# EAGLE design Indev 4 (EAGLE 6.3)
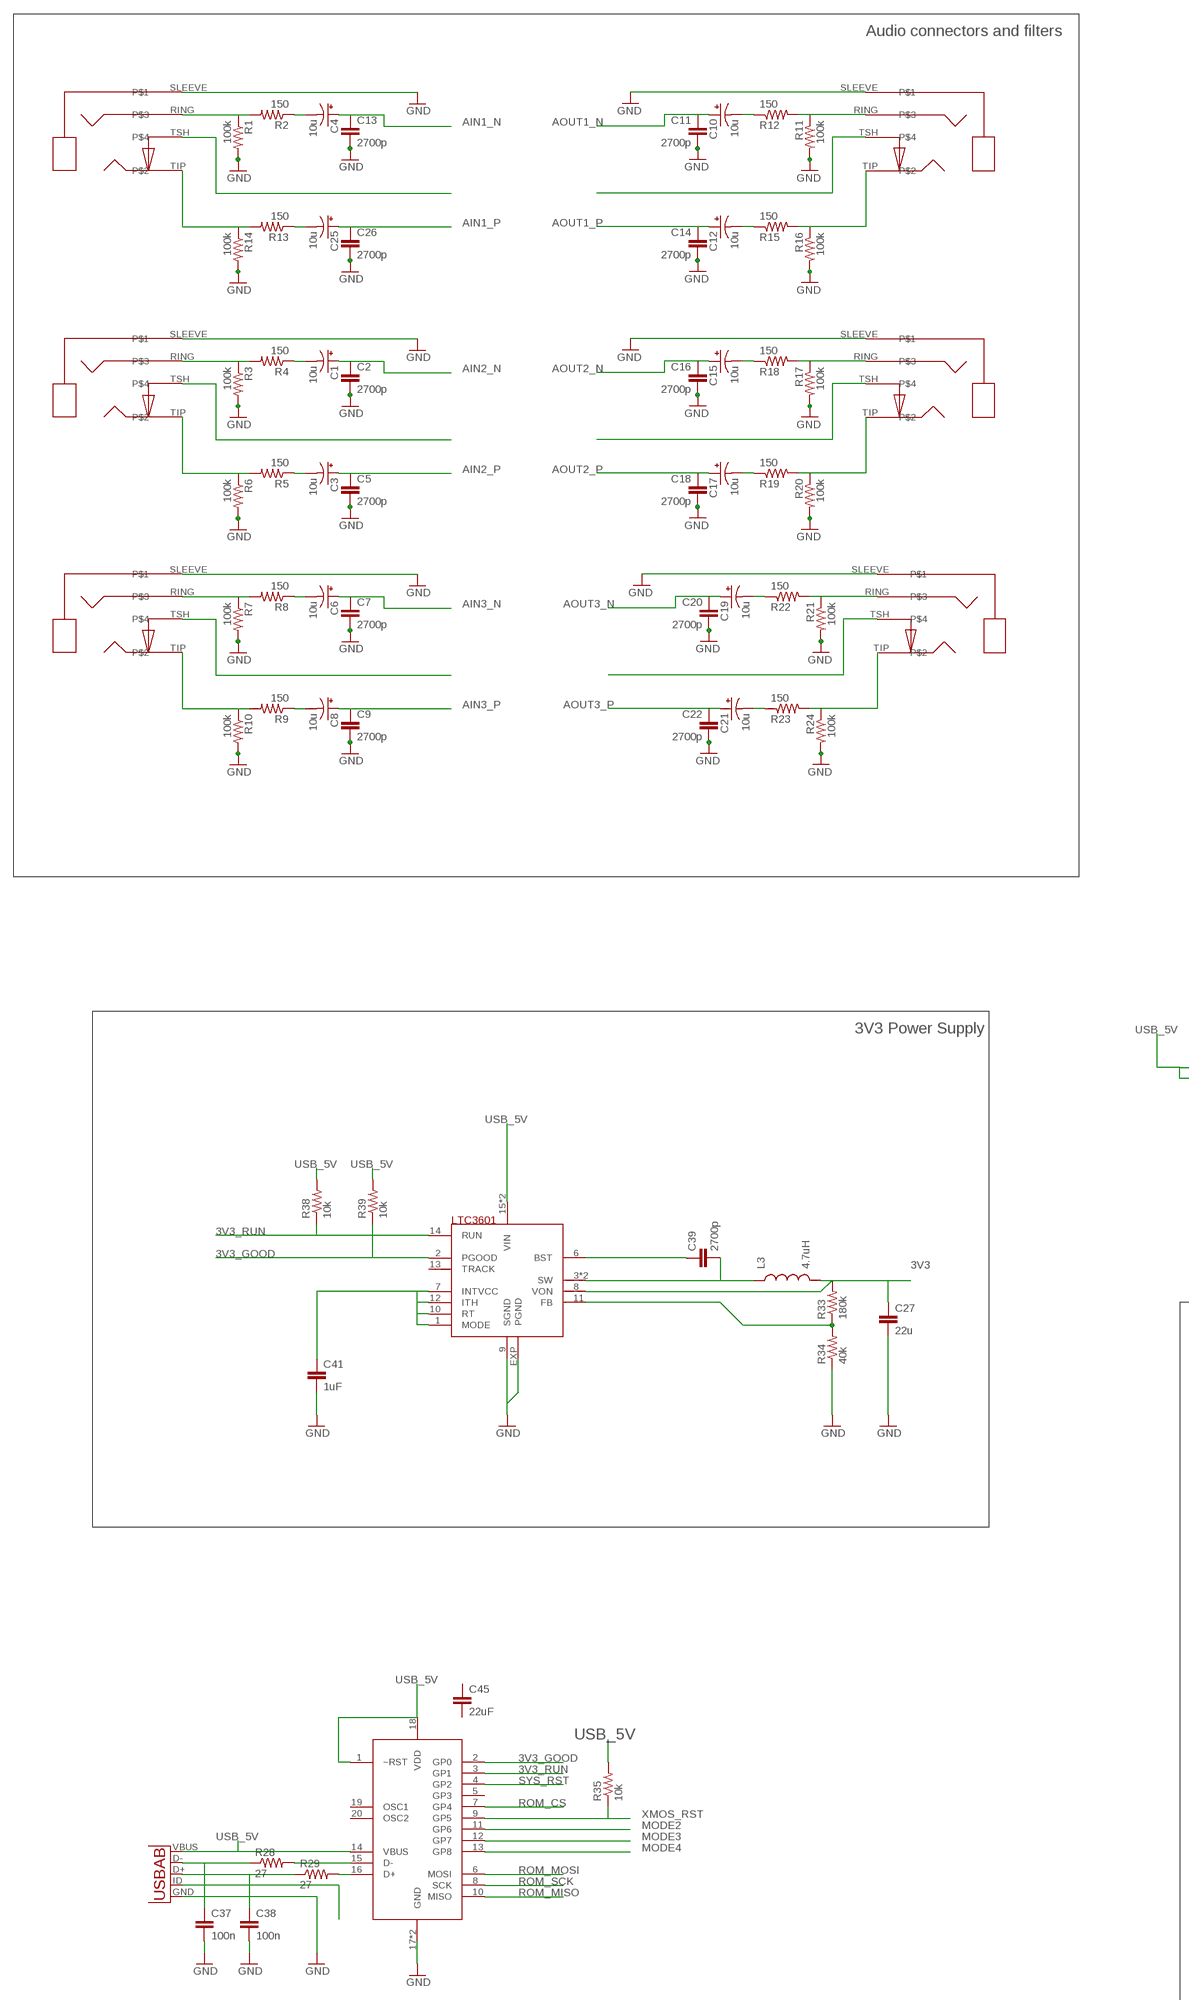
[diagram p0: schematic, sheet 1, part 1 of 2]
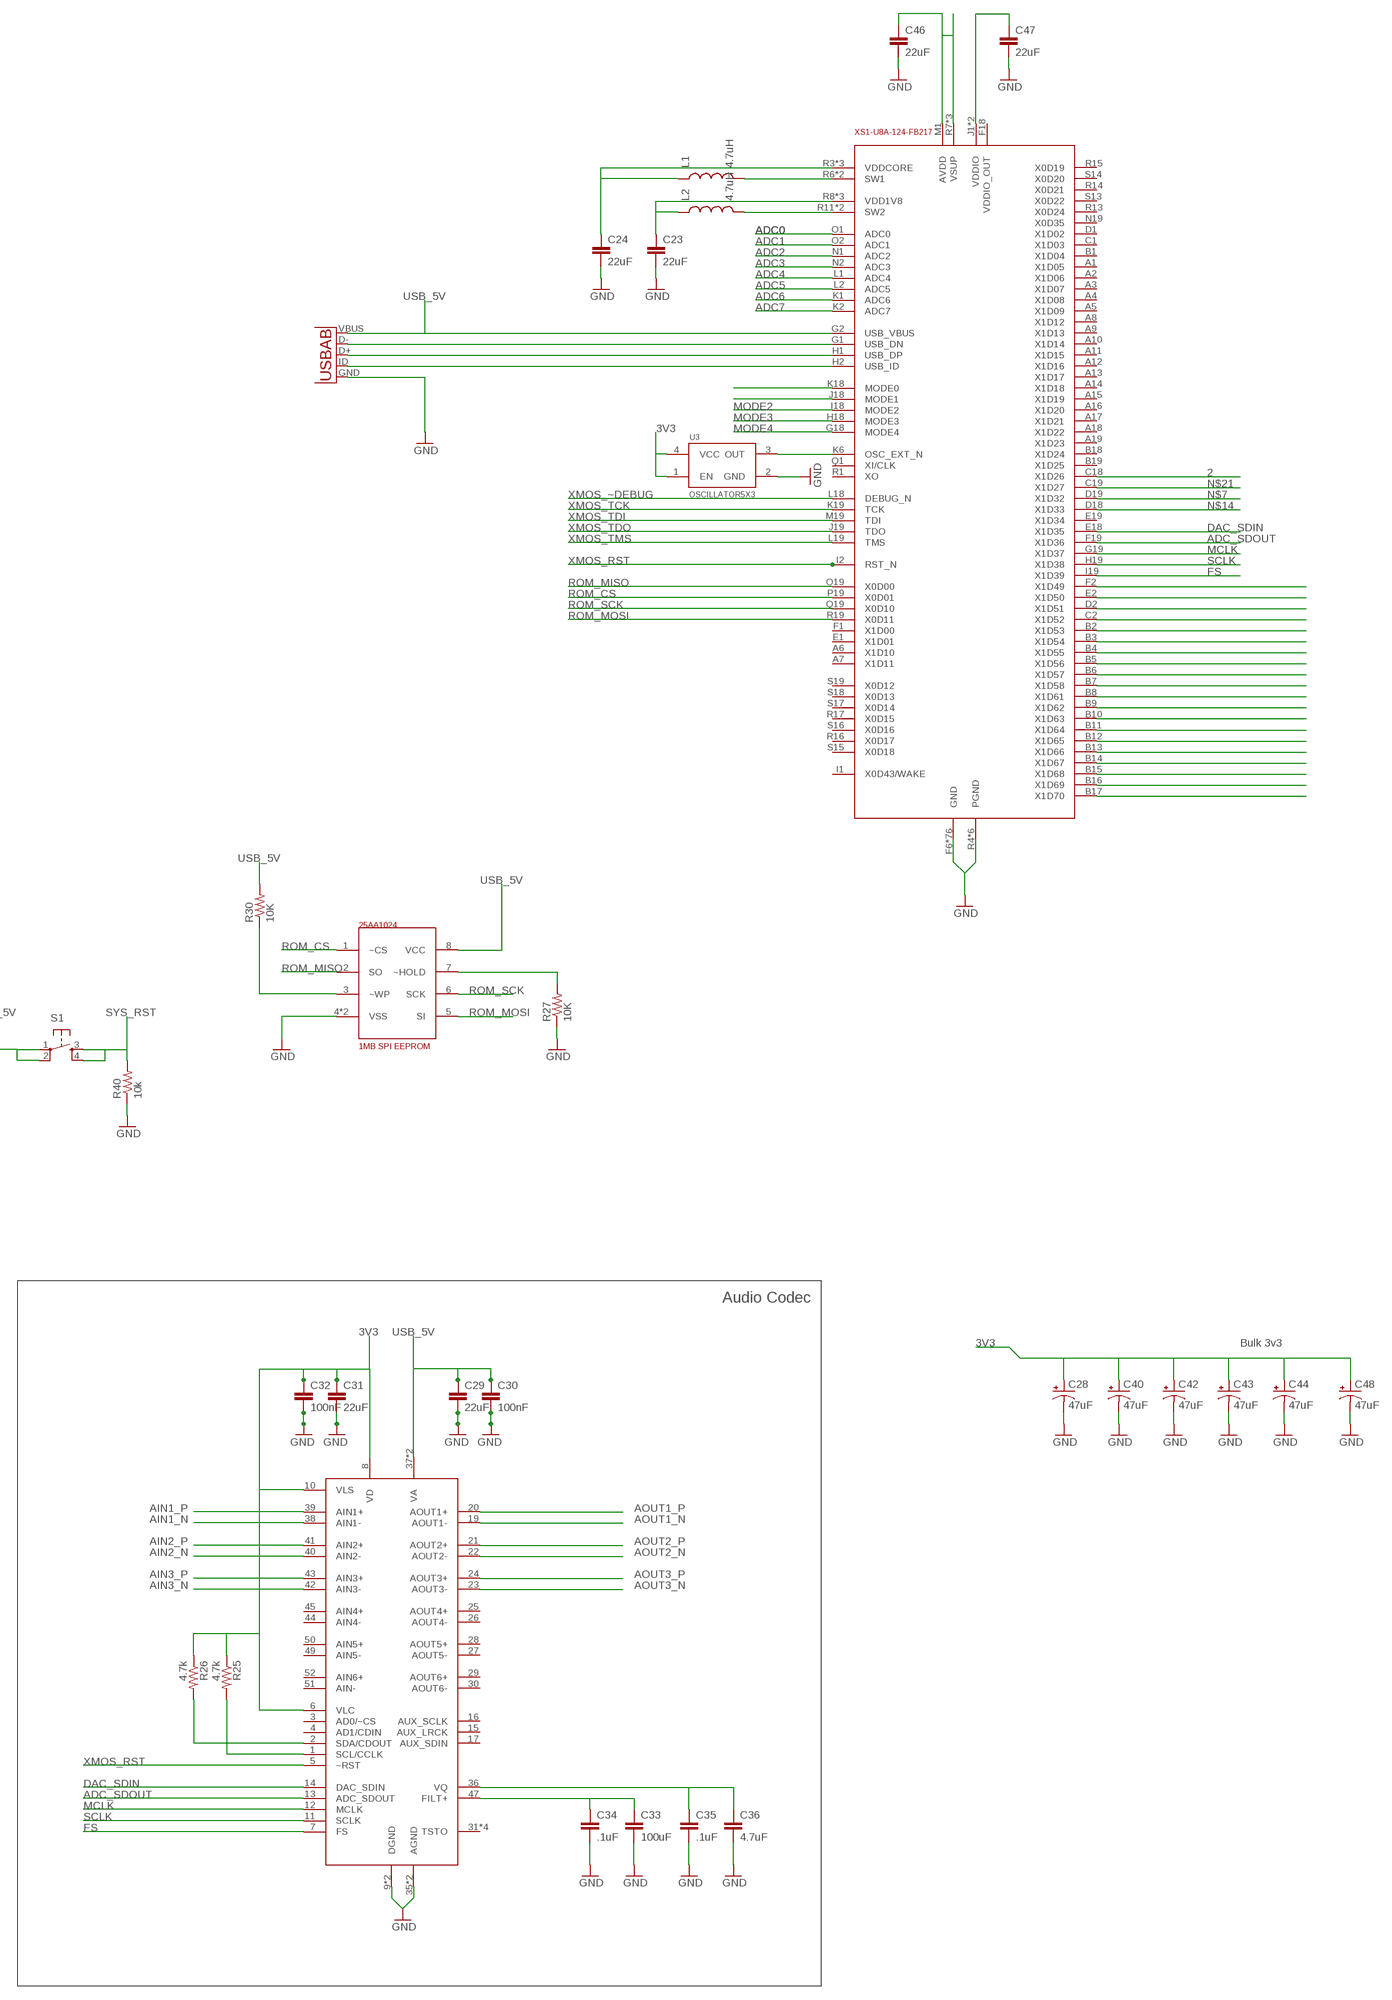
[diagram p1: schematic, sheet 1, part 2 of 2]

## Parts
C1  10u  CPOL-USB  [PANASONIC_B]
C2  2700p  CAP0603-CAP  [0603-CAP]
C3  10u  CPOL-USB  [PANASONIC_B]
C4  10u  CPOL-USB  [PANASONIC_B]
C5  2700p  CAP0603-CAP  [0603-CAP]
C6  10u  CPOL-USB  [PANASONIC_B]
C7  2700p  CAP0603-CAP  [0603-CAP]
C8  10u  CPOL-USB  [PANASONIC_B]
C9  2700p  CAP0603-CAP  [0603-CAP]
C10  10u  CPOL-USB  [PANASONIC_B]
C11  2700p  CAP0603-CAP  [0603-CAP]
C12  10u  CPOL-USB  [PANASONIC_B]
C13  2700p  CAP0603-CAP  [0603-CAP]
C14  2700p  CAP0603-CAP  [0603-CAP]
C15  10u  CPOL-USB  [PANASONIC_B]
C16  2700p  CAP0603-CAP  [0603-CAP]
C17  10u  CPOL-USB  [PANASONIC_B]
C18  2700p  CAP0603-CAP  [0603-CAP]
C19  10u  CPOL-USB  [PANASONIC_B]
C20  2700p  CAP0603-CAP  [0603-CAP]
C21  10u  CPOL-USB  [PANASONIC_B]
C22  2700p  CAP0603-CAP  [0603-CAP]
C23  22uF  CAP0603-CAP  [0603-CAP]
C24  22uF  CAP0603-CAP  [0603-CAP]
C25  10u  CPOL-USB  [PANASONIC_B]
C26  2700p  CAP0603-CAP  [0603-CAP]
C27  22u  CAP0603-CAP  [0603-CAP]
C28  47uF  47UF-TANT  [EIA3528]
C29  22uF  CAP0402-CAP  [0402-CAP]
C30  100nF  CAP0402-CAP  [0402-CAP]
C31  22uF  CAP0402-CAP  [0402-CAP]
C32  100nF  CAP0402-CAP  [0402-CAP]
C33  100uF  CAP0402-CAP  [0402-CAP]
C34  .1uF  CAP0402-CAP  [0402-CAP]
C35  .1uF  CAP0402-CAP  [0402-CAP]
C36  4.7uF  CAP0402-CAP  [0402-CAP]
C37  100n  CAP0603-CAP  [0603-CAP]
C38  100n  CAP0603-CAP  [0603-CAP]
C39  2700p  CAP0603-CAP  [0603-CAP]
C40  47uF  47UF-TANT  [EIA3528]
C41  1uF  CAP0603-CAP  [0603-CAP]
C42  47uF  47UF-TANT  [EIA3528]
C43  47uF  47UF-TANT  [EIA3528]
C44  47uF  47UF-TANT  [EIA3528]
C45  22uF  CAP0402-CAP  [0402-CAP]
C46  22uF  CAP0402-CAP  [0402-CAP]
C47  22uF  CAP0402-CAP  [0402-CAP]
C48  47uF  47UF-TANT  [EIA3528]
J1  SJ3524_AUDIO  [SJ3524_AUDIO]
J2  SJ3524_AUDIO  [SJ3524_AUDIO]
J3  SJ3524_AUDIO  [SJ3524_AUDIO]
J4  SJ3524_AUDIO  [SJ3524_AUDIO]
J5  SJ3524_AUDIO  [SJ3524_AUDIO]
J6  SJ3524_AUDIO  [SJ3524_AUDIO]
L1  4.7uH  INDUCTOR1210  [1210]
L2  4.7uH  INDUCTOR1210  [1210]
L3  4.7uH  INDUCTOR1210  [1210]
R1  100k  R-US_R0402  [R0402]
R2  150  R-US_R0402  [R0402]
R3  100k  R-US_R0402  [R0402]
R4  150  R-US_R0402  [R0402]
R5  150  R-US_R0402  [R0402]
R6  100k  R-US_R0402  [R0402]
R7  100k  R-US_R0402  [R0402]
R8  150  R-US_R0402  [R0402]
R9  150  R-US_R0402  [R0402]
R10  100k  R-US_R0402  [R0402]
R11  100k  R-US_R0402  [R0402]
R12  150  R-US_R0402  [R0402]
R13  150  R-US_R0402  [R0402]
R14  100k  R-US_R0402  [R0402]
R15  150  R-US_R0402  [R0402]
R16  100k  R-US_R0402  [R0402]
R17  100k  R-US_R0402  [R0402]
R18  150  R-US_R0402  [R0402]
R19  150  R-US_R0402  [R0402]
R20  100k  R-US_R0402  [R0402]
R21  100k  R-US_R0402  [R0402]
R22  150  R-US_R0402  [R0402]
R23  150  R-US_R0402  [R0402]
R24  100k  R-US_R0402  [R0402]
R25  4.7k  R-US_R0402  [R0402]
R26  4.7k  R-US_R0402  [R0402]
R27  10K  R-US_R0402  [R0402]
R28  27  R-US_R0402  [R0402]
R29  27  R-US_R0402  [R0402]
R30  10K  R-US_R0402  [R0402]
R33  180k  R-US_R0402  [R0402]
R34  40k  R-US_R0402  [R0402]
R35  10k  R-US_R0402  [R0402]
R38  10k  R-US_R0402  [R0402]
R39  10k  R-US_R0402  [R0402]
R40  10k  R-US_R0402  [R0402]
S1  TAC_SWITCHSMD  [TACTILE_SWITCH_SMD]
U1  USB-AB  [USB-AB-MICRO-SMD]
U2  USB-AB  [USB-AB-MICRO-SMD]
U3  OSCILLATOR5X3  [CRYSTAL-SMD-5X3]
U$1  LTC3601  [QFN16-3X3]
U$2  25AA1024DFN  [DFN8-5X6]
U$3  CS42436  [QFP-52]
U$4  MCP2210QFN  [20-QFN(5X5)]
U$6  XS1-U8A-124-FB217  [217-BGA(.8MM)]

## Nets
2: U$6.C18(X1D26)
3V3: C27.1 C28.A(+) C31.1 C32.1 C40.A(+) C42.A(+) C43.A(+) C44.A(+) C46.1 C47.1 C48.A(+) L3.2 R25.1 R26.1 R33.2 U3.1(EN) U3.4(VCC) U$1.8(VON) U$3.6(VLC) U$3.8(VD) U$3.10(VLS) U$6.J1(VDDIO) U$6.J2(VDDIO) U$6.M1(AVDD) U$6.R7(VSUP) U$6.S1(VSUP) U$6.S7(VSUP)
3V3_GOOD: R39.1 U$1.2(PGOOD) U$4.2(GP0)
3V3_RUN: R38.1 U$1.14(RUN) U$4.3(GP1)
ADC0: U$6.O1(ADC0)
ADC1: U$6.O2(ADC1)
ADC2: U$6.N1(ADC2)
ADC3: U$6.N2(ADC3)
ADC4: U$6.L1(ADC4)
ADC5: U$6.L2(ADC5)
ADC6: U$6.K1(ADC6)
ADC7: U$6.K2(ADC7)
ADC_SDOUT: U$3.13(ADC_SDOUT) U$6.F19(X1D36)
AIN1_N: C4.+ C13.1 U$3.38(AIN1-)
AIN1_P: C25.+ C26.1 U$3.39(AIN1+)
AIN2_N: C1.+ C2.1 U$3.40(AIN2-)
AIN2_P: C3.+ C5.1 U$3.41(AIN2+)
AIN3_N: C6.+ C7.1 U$3.42(AIN3-)
AIN3_P: C8.+ C9.1 U$3.43(AIN3+)
AOUT1_N: C10.+ C11.1 U$3.19(AOUT1-)
AOUT1_P: C12.+ C14.1 U$3.20(AOUT1+)
AOUT2_N: C15.+ C16.1 U$3.22(AOUT2-)
AOUT2_P: C17.+ C18.1 U$3.21(AOUT2+)
AOUT3_N: C19.+ C20.1 U$3.23(AOUT3-)
AOUT3_P: C21.+ C22.1 U$3.24(AOUT3+)
CH1_IN: J1.TSH
CH1O_IN: J4.TSH
CH2_IN: J2.TSH
CH2O_IN: J5.TSH
CH3_IN: J3.TSH
CH3O_IN: J6.TSH
DAC_SDIN: U$3.14(DAC_SDIN) U$6.E18(X1D35)
FB: R33.1 R34.2 U$1.11(FB)
FS: U$3.7(FS) U$6.I19(X1D39)
GND: C2.2 C5.2 C7.2 C9.2 C11.2 C13.2 C14.2 C16.2 C18.2 C20.2 C22.2 C23.2 C24.2 C26.2 C27.2 C28.C(-) C29.2 C30.2 C31.2 C32.2 C33.2 C34.2 C35.2 C36.2 C37.2 C38.2 C40.C(-) C41.2 C42.C(-) C43.C(-) C44.C(-) C46.2 C47.2 C48.C(-) J1.SLEEVE J2.SLEEVE J3.SLEEVE J4.SLEEVE J5.SLEEVE J6.SLEEVE R1.2 R3.2 R6.2 R7.2 R10.2 R11.2 R14.2 R16.2 R17.2 R20.2 R21.2 R24.2 R27.1 R34.1 R40.1 U1.GND U2.GND U3.2(GND) U$1.9(SGND) U$1.EXP(PGND) U$2.4(VSS) U$2.PAD(VSS) U$3.9(DGND) U$3.18(DGND) U$3.35(AGND) U$3.48(AGND) U$4.17(GND) U$4.PAD(GND) U$6.F6(GND) U$6.F7(GND) U$6.F8(GND) U$6.F9(GND) U$6.F10(GND) U$6.F11(GND) U$6.F12(GND) U$6.F13(GND) U$6.F14(GND) U$6.G6(GND) U$6.G7(GND) U$6.G8(GND) U$6.G9(GND) U$6.G10(GND) U$6.G11(GND) U$6.G12(GND) U$6.G13(GND) U$6.G14(GND) U$6.H6(GND) U$6.H7(GND) U$6.H8(GND) U$6.H9(GND) U$6.H10(GND) U$6.H11(GND) U$6.H12(GND) U$6.H13(GND) U$6.H14(GND) U$6.I6(GND) U$6.I7(GND) U$6.I8(GND) U$6.I9(GND) U$6.I10(GND) U$6.I11(GND) U$6.I12(GND) U$6.I13(GND) U$6.I14(GND) U$6.J6(GND) U$6.J7(GND) U$6.J8(GND) U$6.J9(GND) U$6.J10(GND) U$6.J11(GND) U$6.J12(GND) U$6.J13(GND) U$6.J14(GND) U$6.K7(GND) U$6.K8(GND) U$6.K9(GND) U$6.K10(GND) U$6.K11(GND) U$6.K12(GND) U$6.K13(GND) U$6.K14(GND) U$6.L8(GND) U$6.L9(GND) U$6.L10(GND) U$6.L11(GND) U$6.L12(GND) U$6.L13(GND) U$6.L14(GND) U$6.M8(GND) U$6.M9(GND) U$6.M10(GND) U$6.M11(GND) U$6.M12(GND) U$6.M13(GND) U$6.M14(GND) U$6.N6(GND) U$6.N7(GND) U$6.N8(GND) U$6.N9(GND) U$6.N10(GND) U$6.N11(GND) U$6.N12(GND) U$6.N13(GND) U$6.N14(GND) U$6.R4(PGND) U$6.R5(PGND) U$6.R9(PGND) U$6.R10(PGND) U$6.S5(PGND) U$6.S10(PGND)
MCLK: U$3.12(MCLK) U$6.G19(X1D37)
MODE2: U$4.11(GP6) U$6.I18(MODE2)
MODE3: U$4.12(GP7) U$6.H18(MODE3)
MODE4: U$4.13(GP8) U$6.G18(MODE4)
N$1: J1.TIP R13.2 R14.1
N$2: J1.RING R1.1 R2.2
N$3: C4.- R2.1
N$4: C33.1 C34.1 U$3.47(FILT+)
N$5: C25.- R13.1
N$6: C35.1 C36.1 U$3.36(VQ)
N$7: U$6.D19(X1D32)
N$8: J2.RING R3.1 R4.2
N$9: C1.- R4.1
N$10: U$6.K18(MODE0)
N$11: J2.TIP R5.2 R6.1
N$12: C3.- R5.1
N$13: R30.1 U$2.3(~WP)
N$14: U$6.D18(X1D33)
N$15: J3.RING R7.1 R8.2
N$16: C6.- R8.1
N$17: U1.ID(USBID)
N$18: J3.TIP R9.2 R10.1
N$19: C8.- R9.1
N$20: C39.1 U$1.6(BST)
N$21: U$6.C19(X1D27)
N$22: J4.RING R11.1 R12.2
N$23: C10.- R12.1
N$24: C37.1 R28.1 U1.D-
N$25: J4.TIP R15.2 R16.1
N$26: C12.- R15.1
N$29: J5.RING R17.1 R18.2
N$30: C15.- R18.1
N$31: R25.2 U$3.1(SCL/CCLK)
N$32: J5.TIP R19.2 R20.1
N$33: C17.- R19.1
N$34: R26.2 U$3.2(SDA/CDOUT)
N$35: U$6.B17(X1D70)
N$36: J6.RING R21.1 R22.2
N$37: C19.- R22.1
N$39: J6.TIP R23.2 R24.1
N$40: C21.- R23.1
N$41: C38.1 R29.1 U1.D+
N$42: U$6.B16(X1D69)
N$43: R28.2 U$4.15(D-)
N$44: R29.2 U$4.16(D+)
N$46: R27.2 U$2.7(~HOLD)
N$47: U$6.B15(X1D68)
N$48: U$6.B14(X1D67)
N$49: U$6.B13(X1D66)
N$50: U$6.B12(X1D65)
N$51: U$6.B11(X1D64)
N$52: U$6.B10(X1D63)
N$55: U3.3(OUT) U$6.K6(OSC_EXT_N)
N$56: U$6.J18(MODE1)
N$57: L2.2 U$6.R11(SW2) U$6.S11(SW2)
N$58: L1.2 U$6.R6(SW1) U$6.S6(SW1)
N$59: C23.1 L2.1 U$6.R8(VDD1V8) U$6.S8(VDD1V8) U$6.S9(VDD1V8)
N$60: C24.1 L1.1 U$6.R3(VDDCORE) U$6.S3(VDDCORE) U$6.S4(VDDCORE)
N$61: U$6.B9(X1D62)
N$62: U$6.B8(X1D61)
N$63: U$6.F2(X1D49)
N$64: U$6.E2(X1D50)
N$65: U$6.B7(X1D58)
N$66: U$6.B6(X1D57)
N$67: U$6.B5(X1D56)
N$68: U$6.B4(X1D55)
N$69: U$6.B3(X1D54)
N$70: U$6.B2(X1D53)
N$71: U$6.C2(X1D52)
N$72: U$6.D2(X1D51)
ROM_CS: U$2.1(~CS) U$4.7(GP4) U$6.P19(X0D01)
ROM_MISO: U$2.2(SO) U$4.10(MISO) U$6.O19(X0D00)
ROM_MOSI: U$2.5(SI) U$4.6(MOSI) U$6.R19(X0D11)
ROM_SCK: U$2.6(SCK) U$4.8(SCK) U$6.Q19(X0D10)
SCLK: U$3.11(SCLK) U$6.H19(X1D38)
SW: C39.2 L3.1 U$1.3(SW) U$1.4(SW)
SYS_RST: R40.2 S1.3 S1.4 U$4.4(GP2)
TRACK/SS: C41.1 U$1.1(MODE) U$1.7(INTVCC) U$1.10(RT) U$1.12(ITH)
USB_5V: C29.1 C30.1 R30.2 R35.2 R38.2 R39.2 S1.1 S1.2 U1.VBUS U2.VBUS U$1.15(VIN) U$1.16(VIN) U$2.8(VCC) U$3.37(VA) U$3.46(VA) U$4.1(~RST) U$4.14(VBUS) U$4.18(VDD) U$6.G2(USB_VBUS)
XMOS_RST: R35.1 U$3.5(~RST) U$4.9(GP5) U$6.I2(RST_N)
XMOS_TCK: U$6.K19(TCK)
XMOS_TDI: U$6.M19(TDI)
XMOS_TDO: U$6.J19(TDO)
XMOS_TMS: U$6.L19(TMS)
XMOS_USB_ID: U2.ID(USBID) U$6.H2(USB_ID)
XMOS_USB_N: U2.D- U$6.G1(USB_DN)
XMOS_USB_P: U2.D+ U$6.H1(USB_DP)
XMOS_~DEBUG: U$6.L18(DEBUG_N)
Unconnected: C45.1 C45.2 U$1.13(TRACK) U$3.3(AD0/~CS) U$3.4(AD1/CDIN) U$3.15(AUX_LRCK) U$3.16(AUX_SCLK) U$3.17(AUX_SDIN) U$3.25(AOUT4+) U$3.26(AOUT4-) U$3.27(AOUT5-) U$3.28(AOUT5+) U$3.29(AOUT6+) U$3.30(AOUT6-) U$3.31(TSTO) U$3.32(TSTO) U$3.33(TSTO) U$3.34(TSTO) U$3.44(AIN4-) U$3.45(AIN4+) U$3.49(AIN5-) U$3.50(AIN5+) U$3.51(AIN-) U$3.52(AIN6+) U$4.5(GP3) U$4.19(OSC1) U$4.20(OSC2) U$6.A1(X1D05) U$6.A2(X1D06) U$6.A3(X1D07) U$6.A4(X1D08) U$6.A5(X1D09) U$6.A6(X1D10) U$6.A7(X1D11) U$6.A8(X1D12) U$6.A9(X1D13) U$6.A10(X1D14) U$6.A11(X1D15) U$6.A12(X1D16) U$6.A13(X1D17) U$6.A14(X1D18) U$6.A15(X1D19) U$6.A16(X1D20) U$6.A17(X1D21) U$6.A18(X1D22) U$6.A19(X1D23) U$6.B1(X1D04) U$6.B18(X1D24) U$6.B19(X1D25) U$6.C1(X1D03) U$6.D1(X1D02) U$6.E1(X1D01) U$6.E19(X1D34) U$6.F1(X1D00) U$6.F18(VDDIO_OUT) U$6.I1(X0D43/WAKE) U$6.N19(X0D35) U$6.Q1(XI/CLK) U$6.R1(XO) U$6.R13(X0D24) U$6.R14(X0D21) U$6.R15(X0D19) U$6.R16(X0D17) U$6.R17(X0D15) U$6.S13(X0D22) U$6.S14(X0D20) U$6.S15(X0D18) U$6.S16(X0D16) U$6.S17(X0D14) U$6.S18(X0D13) U$6.S19(X0D12)

## Notes on the sheet
- Audio connectors and filters
- 3V3 Power Supply
- Audio Codec
- Bulk 3v3

## Library data of the parts
C1 C3 C4 C6 C8 C10 C12 C15 C17 C19 C21 C25 = adafruit:CPOL-US: POLARIZED CAPACITOR, American symbol
C2 C5 C7 C9 C11 C13 C14 C16 C18 C20 C22-C24 C26 C27 C29-C39 C41 C45-C47 = 1x05smd:CAP: Capacitor Standard 0603 ceramic capacitor, and 0.1" leaded capacitor.
C28 C40 C42-C44 C48 = SparkFun-Capacitors:47UF-TANT: 47uF Tantalum SMT CAP-08310- 10V 10% (EIA-3528); PROD_ID: CAP-08310
J1-J6 = Strutz Electronic Industries:SJ3524_AUDIO
L1-L3 = SparkFun-Passives:INDUCTOR: Inductors Basic Inductor/Choke - 0603 and 1206. Footprints are not proven and vary greatly between part numbers. SRN6045- 33uH, 20% 1.4A SDR0403-560KL - 56uH, 10%, 500mA RMS/740mA peak
R1-R30 R33-R35 R38-R40 = adafruit:R-US_: RESISTOR, American symbol
S1 = SparkFun:TAC_SWITCH: Momentary Switch Button commonly used for reset or general input. Spark Fun Electronics SKU : COM-00097
U1 U2 = SparkFun-Connectors:USB-AB: This is a USB AB connector that is compatible with USB OTG. i.e. this connector can serve as a host or device
U3 = SparkFun-FreqCtrl:OSCILLATOR: Generic 5x3 and 7x5 oscillators
U$1 = Strutz Electronic Industries:LTC3601
U$2 = Strutz Electronic Industries:25AA1024: 1MB SPI EEPROM from Microchip Comes in PDIP, SSOP, DFN
U$3 = Strutz Electronic Industries:CS42436
U$4 = Strutz Electronic Industries:MCP2210: The USB to SPI bridge from Microchip Acts as SPI Master Also comes in SOIC-20 packages
U$6 = Strutz Electronic Industries:XS1-U8A-124-FB217

## Board
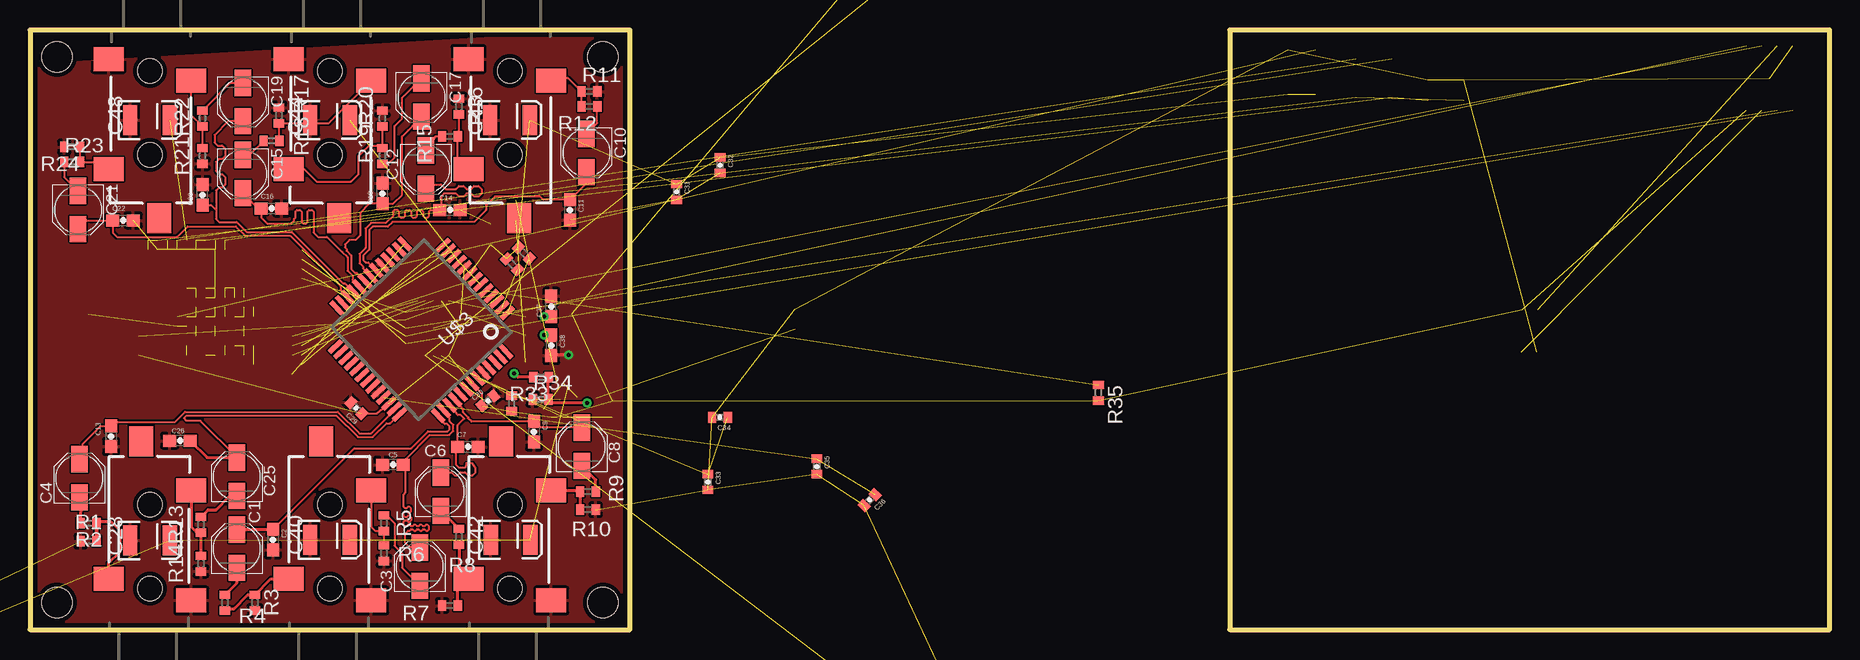
[diagram p2: board, top side]
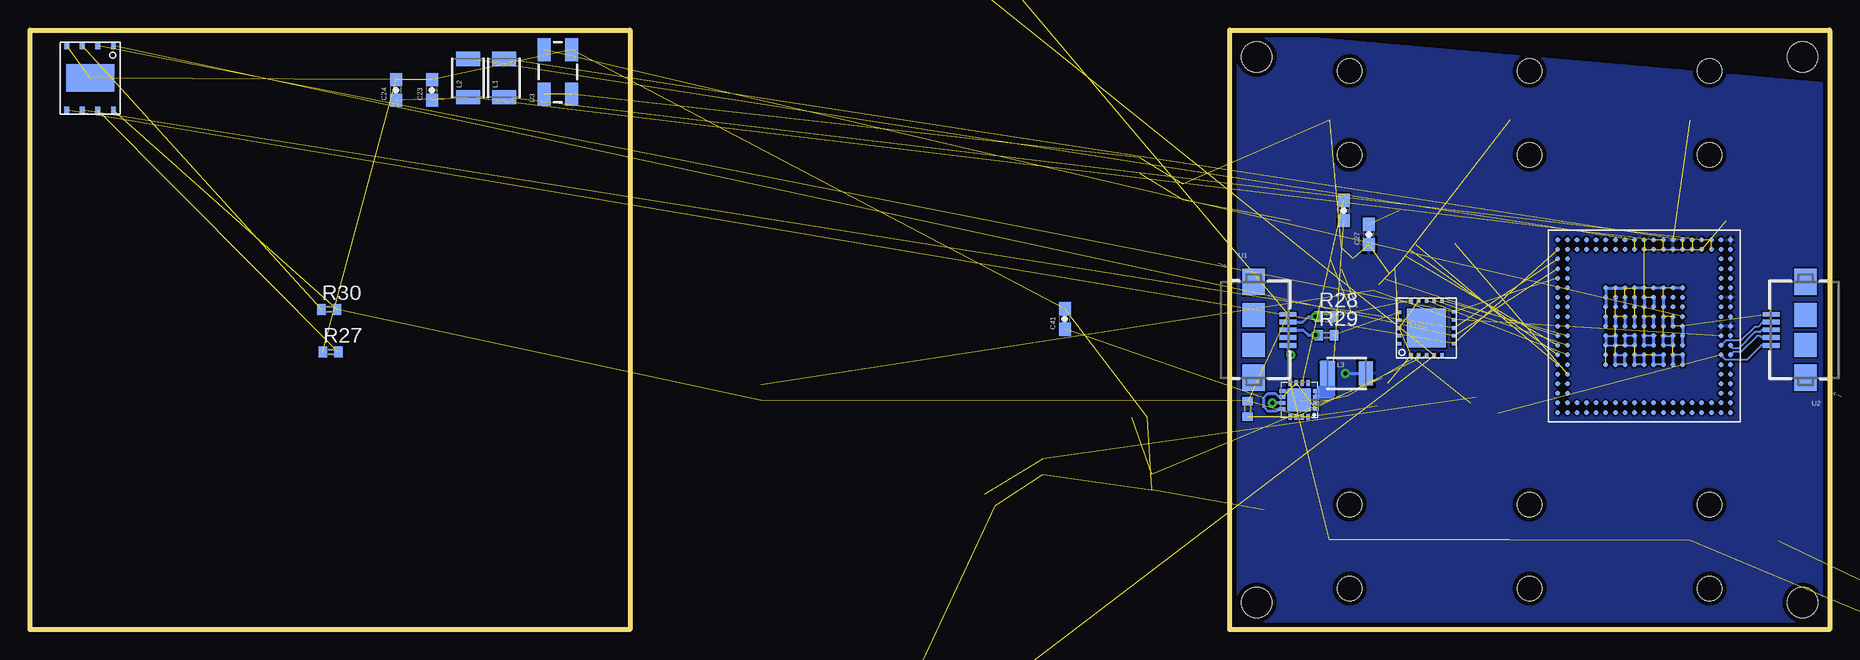
[diagram p3: board, bottom side, seen from below]

Size 150 x 50 mm. Coordinates in mm from the lower left corner, seen from the top.
Outline: 0,0 50,0 50,50 0,50 0,0
Outline: 100,0 150,0 150,50 100,50 100,0
Copper layers (1*16): Top 0.035mm / dielectric 1.5mm / Bottom 0.035mm
Design rules "default *": minimum track width 6mil, minimum drill 13mil, track to track 6mil, track to pad 6mil, pad to pad 6mil, via to via 6mil, smd to smd 6mil, copper to edge 15mil, drill to drill 6mil, minimum pad ring 10mil, minimum via ring 8mil, stop-mask expansion 4mil, vias tented up to drill 0mil, thermal gap 10mil
Holes 2.54 mm at 2.25,47.75 2.25,2.25 47.75,2.25 47.75,47.75

### Footprints (pad centres in the part's own frame; a part is rotated, then mirrored left to right if it is on the bottom)
PANASONIC_B = smd 2.2 x 1.4: + 1.6,0; - -1.6,0
0603-CAP = smd 1.1 x 1: 1 -0.85,0; 2 0.85,0
EIA3528 = smd 1.2 x 2.5: A 1.65,0; C -1.65,0
0402-CAP = smd 0.7 x 0.9: 1 -0.65,0; 2 0.65,0
SJ3524_AUDIO = smd 2 x 2.5: RING -0.78,3.45; SLEEVE -2.58,-3.45; TIP 6.62,-3.45 | smd 2.5 x 2: TSH 10.67,0.75 | hole 2: -1.58,0; 5.42,0
1210 = smd 1.2 x 2: 1 -1.6,0; 2 1.6,0
R0402 = smd 0.7 x 0.9: 1 -0.65,0; 2 0.65,0
TACTILE_SWITCH_SMD = smd 1.524 x 0.762: 1 -2.54,1.905; 2 2.54,1.905; 3 -2.54,-1.905; 4 2.54,-1.905
USB-AB-MICRO-SMD = smd 1.4 x 0.4: D+ 2.85,0; D- 2.85,0.65; GND 2.85,-1.3; ID 2.85,-0.65; VBUS 2.85,1.3 | smd 1.9 x 2: P$6 0,1.25; P$7 0,-1.25 | smd 1.9 x 2.2: P$8 0,4; P$9 0,-4
CRYSTAL-SMD-5X3 = smd 1.9 x 1.1: 1 -1.85,-1.15; 2 1.85,-1.15; 3 1.85,1.15; 4 -1.85,1.15
QFN16-3X3 = smd 0.5 x 0.3: 1 -1.4,0.75; 2 -1.4,0.25; 3 -1.4,-0.25; 4 -1.4,-0.75; 9 1.4,-0.75; 10 1.4,-0.25; 11 1.4,0.25; 12 1.4,0.75 | smd 0.3 x 0.5: 5 -0.75,-1.4; 6 -0.25,-1.4; 7 0.25,-1.4; 8 0.75,-1.4; 13 0.75,1.4; 14 0.25,1.4; 15 -0.25,1.4; 16 -0.75,1.4 | smd 1.95 x 1.95: EXP 0,0
DFN8-5X6 = smd 0.4 x 0.6: 1 -1.95,-2.7; 2 -0.65,-2.7; 3 0.65,-2.7; 4 1.95,-2.7; 5 1.95,2.7; 6 0.65,2.7; 7 -0.65,2.7; 8 -1.95,2.7 | smd 4 x 2.31: PAD 0,0
QFP-52 = smd 1.4 x 0.4: 1 -6.175,3.9; 2 -6.175,3.25; 3 -6.175,2.6; 4 -6.175,1.95; 5 -6.175,1.3; 6 -6.175,0.65; 7 -6.175,0; 8 -6.175,-0.65; 9 -6.175,-1.3; 10 -6.175,-1.95; 11 -6.175,-2.6; 12 -6.175,-3.25; 13 -6.175,-3.9; 27 6.175,-3.9; 28 6.175,-3.25; 29 6.175,-2.6; 30 6.175,-1.95; 31 6.175,-1.3; 32 6.175,-0.65; 33 6.175,0; 34 6.175,0.65; 35 6.175,1.3; 36 6.175,1.95; 37 6.175,2.6; 38 6.175,3.25; 39 6.175,3.9 | smd 0.4 x 1.4: 14 -3.9,-6.175; 15 -3.25,-6.175; 16 -2.6,-6.175; 17 -1.95,-6.175; 18 -1.3,-6.175; 19 -0.65,-6.175; 20 0,-6.175; 21 0.65,-6.175; 22 1.3,-6.175; 23 1.95,-6.175; 24 2.6,-6.175; 25 3.25,-6.175; 26 3.9,-6.175; 40 3.9,6.175; 41 3.25,6.175; 42 2.6,6.175; 43 1.95,6.175; 44 1.3,6.175; 45 0.65,6.175; 46 0,6.175; 47 -0.65,6.175; 48 -1.3,6.175; 49 -1.95,6.175; 50 -2.6,6.175; 51 -3.25,6.175; 52 -3.9,6.175
20-QFN(5X5) = smd 0.4 x 0.3: 1 -2.3,1.3; 2 -2.3,0.65; 3 -2.3,0; 4 -2.3,-0.65; 5 -2.3,-1.3; 11 2.3,-1.3; 12 2.3,-0.65; 13 2.3,0; 14 2.3,0.65; 15 2.3,1.3 | smd 0.3 x 0.4: 6 -1.3,-2.3; 7 -0.65,-2.3; 8 0,-2.3; 9 0.7,-2.3; 10 1.35,-2.3; 16 1.3,2.3; 17 0.65,2.3; 18 0,2.3; 19 -0.65,2.3; 20 -1.3,2.3 | smd 3.25 x 3.25: PAD 0,0
217-BGA(.8MM) = smd 0.4 x 0.4: A1 -7.2,7.2; A2 -6.4,7.2; A3 -5.6,7.2; A4 -4.8,7.2; A5 -4,7.2; A6 -3.2,7.2; A7 -2.4,7.2; A8 -1.6,7.2; A9 -0.8,7.2; A10 0,7.2; A11 0.8,7.2; A12 1.6,7.2; A13 2.4,7.2; A14 3.2,7.2; A15 4,7.2; A16 4.8,7.2; A17 5.6,7.2; A18 6.4,7.2; A19 7.2,7.2; B1 -7.2,6.4; B2 -6.4,6.4; B3 -5.6,6.4; B4 -4.8,6.4; B5 -4,6.4; B6 -3.2,6.4; B7 -2.4,6.4; B8 -1.6,6.4; B9 -0.8,6.4; B10 0,6.4; B11 0.8,6.4; B12 1.6,6.4; B13 2.4,6.4; B14 3.2,6.4; B15 4,6.4; B16 4.8,6.4; B17 5.6,6.4; B18 6.4,6.4; B19 7.2,6.4; C1 -7.2,5.6; C2 -6.4,5.6; C18 6.4,5.6; C19 7.2,5.6; D1 -7.2,4.8; D2 -6.4,4.8; D18 6.4,4.8; D19 7.2,4.8; E1 -7.2,4; E2 -6.4,4; E18 6.4,4; E19 7.2,4; F1 -7.2,3.2; F2 -6.4,3.2; F6 -3.2,3.2; F7 -2.4,3.2; F8 -1.6,3.2; F9 -0.8,3.2; F10 0,3.2; F11 0.8,3.2; F12 1.6,3.2; F13 2.4,3.2; F14 3.2,3.2; F18 6.4,3.2; F19 7.2,3.2; G1 -7.2,2.4; G2 -6.4,2.4; G6 -3.2,2.4; G7 -2.4,2.4; G8 -1.6,2.4; G9 -0.8,2.4; G10 0,2.4; G11 0.8,2.4; G12 1.6,2.4; G13 2.4,2.4; G14 3.2,2.4; G18 6.4,2.4; G19 7.2,2.4; H1 -7.2,1.6; H2 -6.4,1.6; H6 -3.2,1.6; H7 -2.4,1.6; H8 -1.6,1.6; H9 -0.8,1.6; H10 0,1.6; H11 0.8,1.6; H12 1.6,1.6; H13 2.4,1.6; H14 3.2,1.6; H18 6.4,1.6; H19 7.2,1.6; I1 -7.2,0.8; I2 -6.4,0.8; I6 -3.2,0.8; I7 -2.4,0.8; I8 -1.6,0.8; I9 -0.8,0.8; I10 0,0.8; I11 0.8,0.8; I12 1.6,0.8; I13 2.4,0.8; I14 3.2,0.8; I18 6.4,0.8; I19 7.2,0.8; J1 -7.2,0; J2 -6.4,0; J6 -3.2,0; J7 -2.4,0; J8 -1.6,0; J9 -0.8,0; J10 0,0; J11 0.8,0; J12 1.6,0; J13 2.4,0; J14 3.2,0; J18 6.4,0; J19 7.2,0; K1 -7.2,-0.8; K2 -6.4,-0.8; K6 -3.2,-0.8; K7 -2.4,-0.8; K8 -1.6,-0.8; K9 -0.8,-0.8; K10 0,-0.8; K11 0.8,-0.8; K12 1.6,-0.8; K13 2.4,-0.8; K14 3.2,-0.8; K18 6.4,-0.8; K19 7.2,-0.8; L1 -7.2,-1.6; L2 -6.4,-1.6; L6 -3.2,-1.6; L7 -2.4,-1.6; L8 -1.6,-1.6; L9 -0.8,-1.6; L10 0,-1.6; L11 0.8,-1.6; L12 1.6,-1.6; L13 2.4,-1.6; L14 3.2,-1.6; L18 6.4,-1.6; L19 7.2,-1.6; M1 -7.2,-2.4; M2 -6.4,-2.4; M6 -3.2,-2.4; M7 -2.4,-2.4; M8 -1.6,-2.4; M9 -0.8,-2.4; M10 0,-2.4; M11 0.8,-2.4; M12 1.6,-2.4; M13 2.4,-2.4; M14 3.2,-2.4; M18 6.4,-2.4; M19 7.2,-2.4; N1 -7.2,-3.2; N2 -6.4,-3.2; N6 -3.2,-3.2; N7 -2.4,-3.2; N8 -1.6,-3.2; N9 -0.8,-3.2; N10 0,-3.2; N11 0.8,-3.2; N12 1.6,-3.2; N13 2.4,-3.2; N14 3.2,-3.2; N18 6.4,-3.2; N19 7.2,-3.2; O1 -7.2,-4; O2 -6.4,-4; O18 6.4,-4; O19 7.2,-4; P1 -7.2,-4.8; P2 -6.4,-4.8; P18 6.4,-4.8; P19 7.2,-4.8; Q1 -7.2,-5.6; Q2 -6.4,-5.6; Q18 6.4,-5.6; Q19 7.2,-5.6; R1 -7.2,-6.4; R2 -6.4,-6.4; R3 -5.6,-6.4; R4 -4.8,-6.4; R5 -4,-6.4; R6 -3.2,-6.4; R7 -2.4,-6.4; R8 -1.6,-6.4; R9 -0.8,-6.4; R10 0,-6.4; R11 0.8,-6.4; R12 1.6,-6.4; R13 2.4,-6.4; R14 3.2,-6.4; R15 4,-6.4; R16 4.8,-6.4; R17 5.6,-6.4; R18 6.4,-6.4; R19 7.2,-6.4; S1 -7.2,-7.2; S2 -6.4,-7.2; S3 -5.6,-7.2; S4 -4.8,-7.2; S5 -4,-7.2; S6 -3.2,-7.2; S7 -2.4,-7.2; S8 -1.6,-7.2; S9 -0.8,-7.2; S10 0,-7.2; S11 0.8,-7.2; S12 1.6,-7.2; S13 2.4,-7.2; S14 3.2,-7.2; S15 4,-7.2; S16 4.8,-7.2; S17 5.6,-7.2; S18 6.4,-7.2; S19 7.2,-7.2

### Placement (x,y rotation side)
C1  17.25,6.75 90 top
C2  20.25,7.5 270 top
C3  32.5,5.25 90 top
C4  4.12,12.62 90 top
C5  30.25,13.75 180 top
C6  34.25,11.5 90 top
C7  36.5,15.25 0 top
C8  46,15.25 90 top
C9  42,16.5 270 top
C10  46.38,39.75 270 top
C11  45,35 270 top
C12  33,38.38 270 top
C13  6.75,16.12 270 top
C14  35,35 0 top
C15  17.75,38 270 top
C16  20.12,35.12 0 top
C17  32.62,44.38 270 top
C18  29.38,36.38 90 top
C19  17.75,44 270 top
C20  14.38,36.25 90 top
C21  4,35 270 top
C22  7.75,34.12 0 top
C23  116.5,45 90 bottom
C24  119.5,45 90 bottom
C25  17.25,12.75 90 top
C26  12.5,15.75 180 top
C27  38.4,32.95 90 bottom
C28  10,7.45 0 top
C29  27.2,18.47 135 top
C30  38.17,19.07 40 top
C31  53.9,36.5 270 top
C32  57.52,38.73 270 top
C33  56.5,12.3 270 top
C34  57.5,17.7 180 top
C35  65.58,13.6 270 top
C36  69.99,10.8 225 top
C37  43.45,26.95 90 top
C38  43.45,23.7 270 top
C39  40.5,34.95 270 bottom
C40  25,7.5 0 top
C41  63.75,25.9 90 bottom
C42  40.05,7.5 0 top
C43  40,42.5 0 top
C44  25,42.5 0 top
C45  -57.15,-18.8 0 top  (outside the outline)
C46  -57.15,-21.7 0 top  (outside the outline)
C47  -57.15,-24.6 0 top  (outside the outline)
C48  10,42.5 0 top
J1  10,5 90 top
J2  25,5 90 top
J3  40,5 90 top
J4  40,45 270 top
J5  25,45 270 top
J6  10,45 270 top
L1  110.5,46 90 bottom
L2  113.5,46 90 bottom
L3  40.25,21.35 0 bottom
R1  4.88,7.38 180 top
R2  4.88,8.88 0 top
R3  18.75,2.25 270 top
R4  16.25,2.25 270 top
R5  29.5,8.88 270 top
R6  29.5,6.38 270 top
R7  35,2 180 top
R8  35.75,7.75 270 top
R9  46.5,11.5 180 top
R10  46.5,10 0 top
R11  46.62,44.88 0 top
R12  46.62,43.62 180 top
R13  14.25,8.75 270 top
R14  14.25,5.5 270 top
R15  35,41.12 0 top
R16  35.75,43.62 90 top
R17  20.75,42.88 90 top
R18  20.12,40.75 0 top
R19  29.38,39.5 90 top
R20  29.38,42.62 90 top
R21  14.38,39.5 270 top
R22  14.38,42.62 270 top
R23  3.5,39 0 top
R24  3.5,40.25 180 top
R25  41.16,31.4 315 top
R26  40.19,30.46 315 top
R27  124.95,23.15 0 bottom
R28  41.95,26.1 0 bottom
R29  41.95,24.55 0 bottom
R30  125.05,26.7 0 bottom
R33  42.6,21.05 180 top
R34  42.55,19.2 0 top
R35  89.05,19.75 270 top
R38  48.5,18.4 90 bottom
R39  40.15,18.85 270 top
R40  82,-15 0 top  (outside the outline)
S1  71.75,58.15 90 top  (outside the outline)
U1  48,25 0 bottom
U2  2,25 180 bottom
U3  106,46.5 90 bottom
U$1  44.2,19.15 180 bottom
U$2  145,46 180 bottom
U$3  32.62,25 223.3 top
U$4  33.6,25.15 90 bottom
U$6  15.45,25.3 180 bottom

### Tracks (layer width: path | path; a pad name or v marks a point on that pad's centre or on a via)
3V3  (via drill 0.33)  (17 unrouted)
  Top 0.254: R33.2 40.65,21.05 v40.35,21.35
  Bottom 0.254: v40.35,21.35 L3.2
  pour Bottom: -19.95,-7.8 50,0 50,50 -10.8,44.6
3V3_GOOD  (2 unrouted)
3V3_RUN  (2 unrouted)
ADC_SDOUT  (1 unrouted)
AIN1_N
  Top 0.152: U$3.38 30.36,18.27 28.44,16.35 27.46,16.35 25.66,18.15 12.94,18.15 12.55,17.76 12.1,17.3 6.92,17.3 C13.1 5.88,16.98 4.4,15.5 4.4,14.5 C4.+
AIN1_P
  Top 0.152: C25.+ 14.2,17.4 13.05,17.4 12.85,17.64 13.06,17.85 25.54,17.85 27.34,16.05 28.56,16.05 29.72,17.2 30,17.2 30.73,17.93 U$3.39
  Top 0.254: C26.1 14.75,14.35 C25.+
AIN2_N
  Top 0.152: C2.1 27.02,15.12 31.78,15.12 33.19,16.53 34.81,16.53 34.97,16.69 34.97,16.94 34.77,17.14 34.6,17.14 U$3.40
  Top 0.254: C1.+ C2.1
AIN2_P
  Top 0.152: 31.3,14.21 31.1,14.01 C5.1 31.25,13.6 | 31.3,14.21 33.31,16.22 34.94,16.22 35.28,16.56 35.28,17.06 34.98,17.36 34.98,17.68 U$3.41 | C3.+ 31.65,6.85 31.25,7.25 31.25,8 31.5,8.25 31.62,8.25 31.75,8.38 31.88,8.38 32,8.25 32.12,8.25 32.25,8.38 32.38,8.38 32.5,8.25 32.62,8.25 32.75,8.38 32.88,8.38 33,8.25 33.12,8.25 33.25,8.38 33.25,8.62 33.12,8.75 33,8.75 32.88,8.62 32.75,8.62 32.62,8.75 32.5,8.75 32.38,8.62 32.25,8.62 32.12,8.75 32,8.75 31.88,8.62 31.75,8.62 31.62,8.75 31.5,8.75 31.38,8.62 31.25,8.62 31.12,8.75 31.12,9 31.25,9.12 31.38,9.12 31.5,9 31.62,9 31.75,9.12 31.75,9.38 31.62,9.5 31.5,9.5 31.38,9.38 31.25,9.38 31.12,9.5 31.12,9.75 31.25,9.88 31.38,9.88 31.5,9.75 31.62,9.75 31.75,9.88 31.75,10.12 31.62,10.25 31.5,10.25 31.38,10.12 31.25,10.12 31.12,10.25 31.12,11.25 31.3,11.42 31.3,14.21
AIN3_N
  Top 0.152: C6.+ 35.15,13.1 35.38,12.88 35.62,12.88 35.88,13.12 36.25,13.12 36.5,12.88 36.88,12.88 37.12,13.12 37.12,13.5 36.88,13.88 36.38,13.88 36.25,13.5 35.75,13.5 35.5,13.75 35.5,14.9 C7.1 35.65,17.05 36.19,17.59 35.89,17.89 35.68,17.89 U$3.42
AIN3_P
  Top 0.152: C8.+ 42.5,16.85 C9.1 36.8,17.35 36.53,17.62 36.53,17.69 36.11,18.11 36.11,18.38 U$3.43
AOUT1_N
  Top 0.152: C10.+ 46.38,37.23 C11.1 42.77,35.85 42.5,36.12 38.75,36.12 38,35.38 38,35 37,34 30.22,34 29.81,33.6 28.56,33.6 28.28,33.31 28.28,31.69 27.78,31.19 27.78,30.81 27.98,30.61 28.2,30.61 U$3.19
AOUT1_P
  Top 0.152: C12.+ 33.27,36.77 33.38,37.12 34.25,37.12 34.62,36.75 35.5,36.75 35.75,37 36.12,37 36.38,36.75 36.75,36.75 37,37 37.38,37 37.62,36.75 37.62,36.38 37.38,36.12 37,36.12 36.75,36.38 36.38,36.38 36.12,36.12 35.75,36.12 35.5,36.38 34.5,36.38 34.25,36.12 34.25,35.1 C14.1 33.38,35 33.25,34.88 33.25,34.5 33.12,34.38 32.88,34.38 32.75,34.5 32.75,34.88 32.62,35 32.38,35 32.25,34.88 32.25,34.5 32.12,34.38 31.88,34.38 31.75,34.5 31.75,34.88 31.62,35 31.38,35 31.25,34.88 31.25,34.5 31.12,34.38 30.88,34.38 30.75,34.5 30.75,34.88 30.62,35 30.38,35 30.25,34.88 30.25,34.5 29.65,33.9 28.44,33.9 27.97,33.44 27.97,31.81 27.47,31.31 27.47,30.56 27.77,30.27 27.77,30.12 U$3.20
AOUT2_N
  Top 0.152: C15.+ 19.02,35.12 C16.1 19.27,34.35 19.75,33.88 21.75,33.88 22,34.12 22,34.25 22.12,34.38 22.12,34.88 22.25,35 22.5,35 22.62,34.88 22.62,34 22.75,33.88 23,33.88 23.12,34 23.12,34.88 23.25,35 23.5,35 23.62,34.88 23.62,33.12 24,32.75 24.75,32.75 26,31.5 26.03,31.5 26.47,31.06 26.47,29.94 26.89,29.52 26.89,29.15 U$3.22
AOUT2_P
  Top 0.152: C17.+ 32.12,42.27 31.5,41.62 31,41.12 31,36.25 30.27,35.52 C18.1 28.27,35.52 27.5,34.75 27.5,32.88 27.12,32.5 26.62,32.5 26.25,32.12 26.25,31.88 26.38,31.75 26.38,31.59 26.78,31.19 26.78,30.06 27.11,29.73 27.23,29.73 U$3.21
AOUT3_N
  Top 0.152: C19.+ 16.52,42.4 15.38,41.25 15.38,40.62 15.62,40.38 16,40.38 16.25,40.12 16.25,39.5 16,39.25 15.75,39.25 15.5,39 15.5,38.25 15.75,38 16,38 16.25,37.75 16.25,37.12 16,36.88 15.75,36.88 15.5,36.62 15.5,35 | 15.5,35 15.5,34.25 15.75,34 17.22,34 18.06,33.15 21.81,33.15 26.11,28.86 26.27,28.86 U$3.23 | C20.1 15.1,35.4 15.5,35
AOUT3_P
  Top 0.152: C21.+ 4.72,34.12 C22.1 6.9,33.1 7.25,32.75 12.25,32.75 13.12,33.62 17.16,33.62 17.94,32.85 21.69,32.85 25.89,28.64 25.89,28.32 U$3.24
DAC_SDIN  (1 unrouted)
FB  (via drill 0.33)
  Top 0.254: R33.1 43.2,21 R34.2 43.5,18.9 v46.45,18.9
  Bottom 0.254: U$1.11 v46.45,18.9
FS  (1 unrouted)
GND  (via drill 0.33)  (56 unrouted)
  Top 0.254: v44.9,22.9 43.5,22.9 C38.2
  Bottom 0.15: U$6.G6 U$6.G7 | U$6.G11 U$6.G10 | U$6.G13 U$6.G12 | U$6.I14 U$6.I13 | U$6.H14 U$6.H13 | U$6.H12 U$6.H11 | U$6.I11 U$6.I12 | U$6.I9 U$6.I10 | U$6.H9 U$6.H10 | U$6.H7 U$6.H8 | U$6.I8 U$6.I7
  Bottom 0.152: U$6.F10 U$6.F11 | U$6.F12 U$6.F13 | U$6.G9 U$6.G8 | U$6.F8 U$6.F9
  Bottom 0.254: U$6.G6 U$6.F6 | U$6.F8 U$6.G8 | U$6.F9 U$6.G9 | U$6.F10 U$6.G10 | U$6.F11 U$6.G11 | U$6.F12 U$6.G12 | U$6.F13 U$6.G13 | U$6.I14 U$6.H14 | U$6.I13 U$6.H13 | U$6.I12 U$6.H12 | U$6.I11 U$6.H11 | U$6.H10 U$6.I10 | U$6.H9 U$6.I9 | U$6.H8 U$6.I8 | U$6.H7 U$6.I7 | U$6.H6 U$6.I6 U$6.J6 | U$6.J7 U$6.K7 | U$6.J8 U$6.K8 | U$6.J9 U$6.K9 | U$6.J10 U$6.K10 | U$6.J11 U$6.K11 | U$6.K12 U$6.J12 | U$6.K13 U$6.J13 | U$6.K14 U$6.J14 | U$6.L14 U$6.M14 U$6.N14 U$6.N13 U$6.N12 | U$6.M13 U$6.L13 | U$6.M12 U$6.L12 | U$6.M11 U$6.L11 | U$6.M10 U$6.L10 | U$6.M9 U$6.L9 | U$6.M8 U$6.L8 | U$6.N6 U$6.N7 | U$6.N8 U$6.N9 | U$6.N10 U$6.N11 | U$6.G7 U$6.F7 | U$1.9 44.95,19.9 U$1.EXP | U1.GND 45.15,23.15 v44.9,22.9
  pour Top: -19.55,-6.25 50,0 50,50 -9.9,46.5
MCLK  (1 unrouted)
MODE2  (1 unrouted)
MODE3  (1 unrouted)
MODE4  (1 unrouted)
N$1
  Top 0.254: J1.TIP 13.45,8.55 13.75,8.25 14.35,8.25 R13.2 R14.1
N$2
  Top 0.254: J1.RING 6.55,5.55 7.5,6.5 7.5,8.25 6.75,9 5.6,9 R1.1 R2.2
N$3
  Top 0.254: R2.1 4.25,10.75 4,11 C4.-
N$4  (2 unrouted)
N$5
  Top 0.254: R13.1 14.85,10 15.5,10 16.65,11.15 C25.-
N$6  (2 unrouted)
N$8
  Top 0.254: R4.2 16.4,1.75 17,1.75 18.15,2.9 R3.1 20.07,4.22 J2.RING
N$9
  Top 0.254: R4.1 17.25,3.9 C1.-
N$11
  Top 0.152: J2.TIP 28.45,8.55 28.75,8.25 29.48,8.25 R5.2 R6.1
N$12
  Top 0.152: R5.1 29.73,9.53 30.38,8.88 30.38,7 31,6.38 31,5.15 C3.-
N$13  (1 unrouted)
N$15
  Top 0.254: R8.2 35.75,4.25 | 35.75,4.25 36.52,4.25 J3.RING | R7.1 35.65,4.15 35.75,4.25
N$16
  Top 0.254: C6.- R8.1
N$18
  Top 0.254: J3.TIP 45.73,11.62 R9.2 R10.1
N$19
  Top 0.254: R9.1 47.15,12.5 C8.-
N$20  (1 unrouted)
N$22
  Top 0.152: R12.2 R11.1 44.85,46 42.75,46 42.97,45.78 J4.RING
N$23
  Top 0.152: C10.- 47.27,42.25 R12.1
N$24  (via drill 0.33)
  Top 0.254: v42.85,26.1 C37.1
  Bottom 0.254: R28.1 v42.85,26.1 C37.1 43.9,25.65 U1.D-
N$25
  Top 0.152: J4.TIP 35.65,39.28 R15.2 35.75,41.23 R16.1
N$26
  Top 0.152: R15.1 33.77,41.12 C12.-
N$29
  Top 0.152: R18.2 20.75,40.77 R17.1 24.89,42.23 J5.RING
N$30
  Top 0.152: R18.1 18.32,39.6 C15.-
N$31  (1 unrouted)
N$32
  Top 0.152: J5.TIP 22.87,38.38 23.88,37.38 26.75,37.38 27.38,38 27.38,39.5 28.25,40.38 29.15,40.38 R19.2 R20.1
N$33
  Top 0.152: R19.1 29.85,38.85 30.38,39.38 30.38,42 31,42.62 31,44.35 C17.-
N$34  (1 unrouted)
N$36
  Top 0.152: J6.RING 13.45,42.9 R22.2 R21.1
N$37
  Top 0.152: R22.1 16.7,45.6 C19.-
N$39
  Top 0.152: R24.1 R23.2 5.93,39 J6.TIP
N$40
  Top 0.152: R23.1 2.85,37.75 C21.-
N$41  (via drill 0.33)
  Top 0.254: v42.85,24.55 C38.1
  Bottom 0.254: R29.1 v42.85,24.55 C38.1 43.9,25 U1.D+
N$43  (1 unrouted)
N$44  (1 unrouted)
N$46  (1 unrouted)
N$55  (1 unrouted)
N$57  (2 unrouted)
N$58  (2 unrouted)
N$59  (4 unrouted)
N$60  (4 unrouted)
ROM_CS  (2 unrouted)
ROM_MISO  (2 unrouted)
ROM_MOSI  (2 unrouted)
ROM_SCK  (2 unrouted)
SCLK  (1 unrouted)
SW  (1 unrouted)
  Bottom 0.152: U$1.4 U$1.3
  Bottom 0.254: U$1.4 42.8,19.45 42.75,19.4 41.5,19.4 41.3,19.6 41.3,20.2 | 41.3,20.2 41.3,20.25 | 41.3,20.25 41.35,20.3 42.4,20.3 U$1.4 | U$1.4 42.8,19.75 42.6,19.55 41.6,19.55 41.5,19.65 41.5,20.1 42.35,20.1 42.6,19.85 42.45,19.7 41.75,19.7 41.7,19.75 41.7,19.9 42.4,19.9 42.4,19.85 41.65,19.85 41.3,20.2 | 41.3,20.25 41.3,22.3 42.4,22.3 42.4,20.2 41.8,20.2 41.75,20.25 41.75,21.25 L3.1
SYS_RST  (3 unrouted)
TRACK/SS  (3 unrouted)
  Bottom 0.254: U$1.10 45.9,19.4 46.15,19.65 46.85,19.65 47.2,19.3 47.2,18.6 46.8,18.2 46.1,18.2 45.9,18.4 U$1.12
USB_5V  (15 unrouted)
  Top 0.152: C29.1 28.91,18.01 U$3.37 | C30.1 37.68,19.66 U$3.46
  Bottom 0.152: U2.VBUS 5.7,23.7 6.9,22.5 8.65,22.5 U$6.G2
XMOS_RST  (3 unrouted)
XMOS_USB_ID
  Bottom 0.152: U2.ID 5.55,25.65 5.95,25.25 6.25,25.25 7.4,24.1 8.65,24.1 U$6.H2
XMOS_USB_N
  Bottom 0.152: U2.D- 5.65,24.35 5.8,24.5 6.04,24.5 7.39,23.15 8,23.15 U$6.G1
XMOS_USB_P
  Bottom 0.152: U2.D+ 5.6,25 5.8,24.8 6.21,24.8 7.56,23.45 8,23.45 U$6.H1